# Altium schematic sheet Power_Supply.SchDoc: MAX_2870
size A4; Author: Salil Tembe; Organization: Salil Tembe; Address1: Nuclearrambo.com; Address2: admin@nuclearrambo.com; DocumentNumber: 3; Revision: 2; SheetNumber: 3; SheetTotal: 3
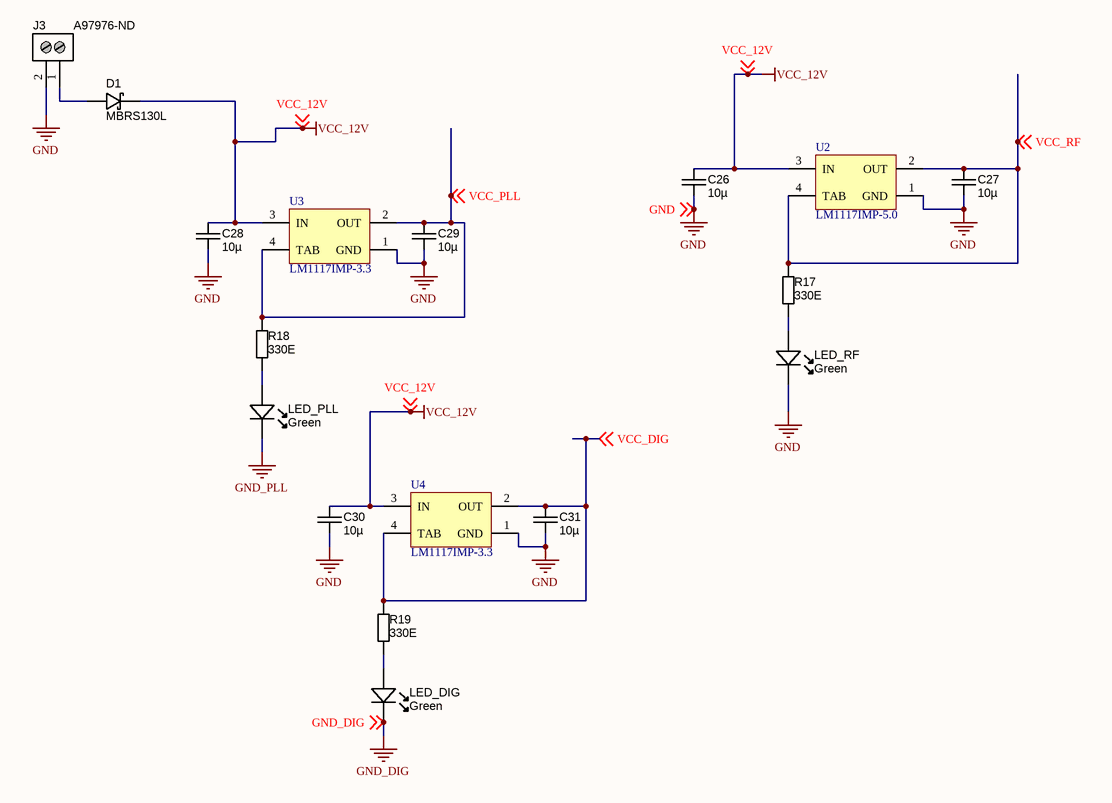
[diagram p0: Power_Supply.SchDoc]

## Parts
C26  value 10µ  [CAPC3216X180N]  (hidden comment: approved sub OK)
C27  value 10µ  [CAPC3216X180N]  (hidden comment: approved sub OK)
C28  value 10µ  [CAPC3216X180N]  (hidden comment: approved sub OK)
C29  value 10µ  [CAPC3216X180N]  (hidden comment: approved sub OK)
C30  value 10µ  [CAPC3216X180N]  (hidden comment: approved sub OK)
C31  value 10µ  [CAPC3216X180N]  (hidden comment: approved sub OK)
D1  MBRS130L  [DO-214AA]
J3  Supplier Part Number 1: A97976-ND  [2P_PCB_ScrewTerm_90S_3.81MM]  (hidden comment: Stackable ScrewTerm)
LED_DIG  Green  [LED-0603-GREEN]
LED_PLL  Green  [LED-0603-GREEN]
LED_RF  Green  [LED-0603-GREEN]
R17  value 330E  [RESC1608X55N]  (hidden comment: Thick Film)
R18  value 330E  [RESC1608X55N]  (hidden comment: Thick Film)
R19  value 330E  [RESC1608X55N]  (hidden comment: Thick Film)
U2  LM1117IMP-5.0  [SOT223_L]
U3  LM1117IMP-3.3  [SOT223_L]
U4  LM1117IMP-3.3  [SOT223_L]

## Nets
GND: C26.2 C27.2 C28.2 C29.2 C30.2 C31.2 J3.2 LED_RF.K U2.1(GND) U3.1(GND) U4.1(GND) ; off-sheet GND
GND_DIG: LED_DIG.K ; off-sheet GND_DIG
GND_PLL: LED_PLL.K
VCC_12V: C26.1 C28.1 C30.1 D1.K U2.3(IN) U3.3(IN) U4.3(IN) ; off-sheet VCC_12V
VCC_DIG: C31.1 R19.1 U4.2(OUT) U4.4(TAB) ; off-sheet VCC_DIG
VCC_PLL: C29.1 R18.1 U3.2(OUT) U3.4(TAB) ; off-sheet VCC_PLL
VCC_RF: C27.1 R17.1 U2.2(OUT) U2.4(TAB) ; off-sheet VCC_RF
NetD1_A: D1.A J3.1
NetLED_DIG_A: LED_DIG.A R19.2
NetLED_PLL_A: LED_PLL.A R18.2
NetLED_RF_A: LED_RF.A R17.2

## Notes on the sheet
- Title
- Size:
- A4
- Number:
- Revision:
- Date:
- Time:
- Sheet
- of

## Library data of the parts
C26-C31 = CAPC_10u_1206_16V: Capacitor SMD Cer 10uF 10% 16V X7R 1206; Manufacturer 1: Kemet; Manufacturer Part Number 1: C1206C106K4RACTU; Ratings: 16V; X7R; SCDType: spec; Material: ceramic; Tolerance: ±10%; Package / Case: 1206 (3216 metric); Supplier 1: Digi-Key; Supplier Part Number 1: 399-3525-1-ND
D1 = DIODE_SCHOTTKY_MBRS130L: Diode Schottky SMD 30V 2A DO-214AA; Manufacturer 1: Fairchild Semiconductor; Material: Si; Ratings: 30Vr; 2A; SCDType: source; Package / Case: DO-214AA, SMB; Supplier 1: Digi-Key; Supplier Part Number 1: MBRS130LFSCT-ND; Manufacturer Part Number 1: MBRS130L
J3 = 2P_ScrewTerm_90S_3.81MM: Terminal Block Screw Type THT 2-Position 3.81mm pitch; Manufacturer 1: Tyco Electronics; Manufacturer Part Number 1: 1776113-2; Value: 2 position; Pitch: 0.150" (3.81mm); Positions Per Level: 2; SCDType: undef; Package / Case: Side Entry; 3.81mm pitch; Category: Connectors Interconnects; Color: Black; Supplier 1: Digi-Key
LED_DIG LED_PLL LED_RF = LED_SMD_Green_0603_570nm: LED 0603 SMD Green 570nm 50mcd 20mA; Manufacturer 1: Kingbright Company LLC; Manufacturer Part Number 1: APT1608CGCK; Ratings: 20mcd min; 50 mcd typ; 570 nm; Voltage - Forward (Vf) Typ: 2.1V; Viewing Angle: 120°; Lens Style/Size: Rectangle with Flat Top, 1.1mm x 0.8mm; Voltage - Forward (Vf) @ 10mA: 2.0V; SCDType: source; Wavelength - Peak: 574nm; Lens Type: Clear; Package / Case: 0603 (1608 metric); Material: AlGaInP; Color: Green; Current - Test: 20mA; Supplier 1: Digi-Key; Supplier Part Number 1: 754-1116-1-ND; RoHS 1: RoHS Compliant; Wavelength - Dominant: 570nm; ComponentLink1URL: http://www.us.kingbright.com/images/catalog/SPEC/APT1608CGCK.pdf; ComponentLink1Description: http://www.us.kingbright.com/images/catalog/SPEC/APT1608CGCK.pdf
R17-R19 = RES_1K5_0603_5%: Resistor SMD chip 1.5k Ohm 0.1W 5% 0603; Manufacturer 1: Yageo; Manufacturer Part Number 1: RC0603JR-071K5L; Ratings: 1/10 W; SCDType: spec; Package / Case: 0603 (1608 metric); Tolerance: ±5%; Material: thick film; Supplier 1: Digi-Key; Supplier Part Number 1: 311-1.5KGRCT-ND
U2 = LM1117IMP-5.0: 800mA Low-Dropout Linear Regulator, 4-pin SOT-223; Manufacturer: National Semiconductor; PackageTopMarking: XYTT*N06B; PowerWise: N; CompType: LDO IC; Published: 4-Dec-2008; DatasheetVersion: Apr-2006; PackageVersion: revB, Apr-2003; PackageReference: MP04A; Publisher: Altium Limited; PackageDescription: Molded SOT-223, 6.50 x 3.56 x 1.6mm Body, 4 Lead, 2.3mm Pitch; Supplier 1: Farnell; Supplier Part Number 1: 7614135; PartNumber: LM1117IMP-5.0; RoHS: N; PinCount: 4; Code_JEDEC: TO-261-AA; Code_IPC: SOT223-4; ComponentLink1Description: LM1117 Datasheet; ComponentLink1URL: http://www.national.com/ds/LM/LM1117.pdf; ComponentLink2Description: LM1117 Web Page; ComponentLink2URL: http://www.national.com/pf/LM/LM1117.html; ComponentLink3Description: MP04A Package Page; ComponentLink3URL: http://www.national.com/packaging/folders/mp04a.html
U3 U4 = LM1117IMP-3.3: 800mA Low-Dropout Linear Regulator, 4-pin SOT-223; Manufacturer: National Semiconductor; PackageTopMarking: XYTT*N05B; PowerWise: N; CompType: LDO IC; Published: 4-Dec-2008; DatasheetVersion: Apr-2006; PackageVersion: revB, Apr-2003; PackageReference: MP04A; Publisher: Altium Limited; PackageDescription: Molded SOT-223, 6.50 x 3.56 x 1.6mm Body, 4 Lead, 2.3mm Pitch; Supplier 1: Farnell; Supplier Part Number 1: 7614123; PartNumber: LM1117IMP-3.3; RoHS: N; PinCount: 4; Code_JEDEC: TO-261-AA; Code_IPC: SOT223-4; ComponentLink1Description: LM1117 Datasheet; ComponentLink1URL: http://www.national.com/ds/LM/LM1117.pdf; ComponentLink2Description: LM1117 Web Page; ComponentLink2URL: http://www.national.com/pf/LM/LM1117.html; ComponentLink3Description: MP04A Package Page; ComponentLink3URL: http://www.national.com/packaging/folders/mp04a.html